# Altium schematic sheet JS7628_base_uart_v1.0.SchDoc
size A4
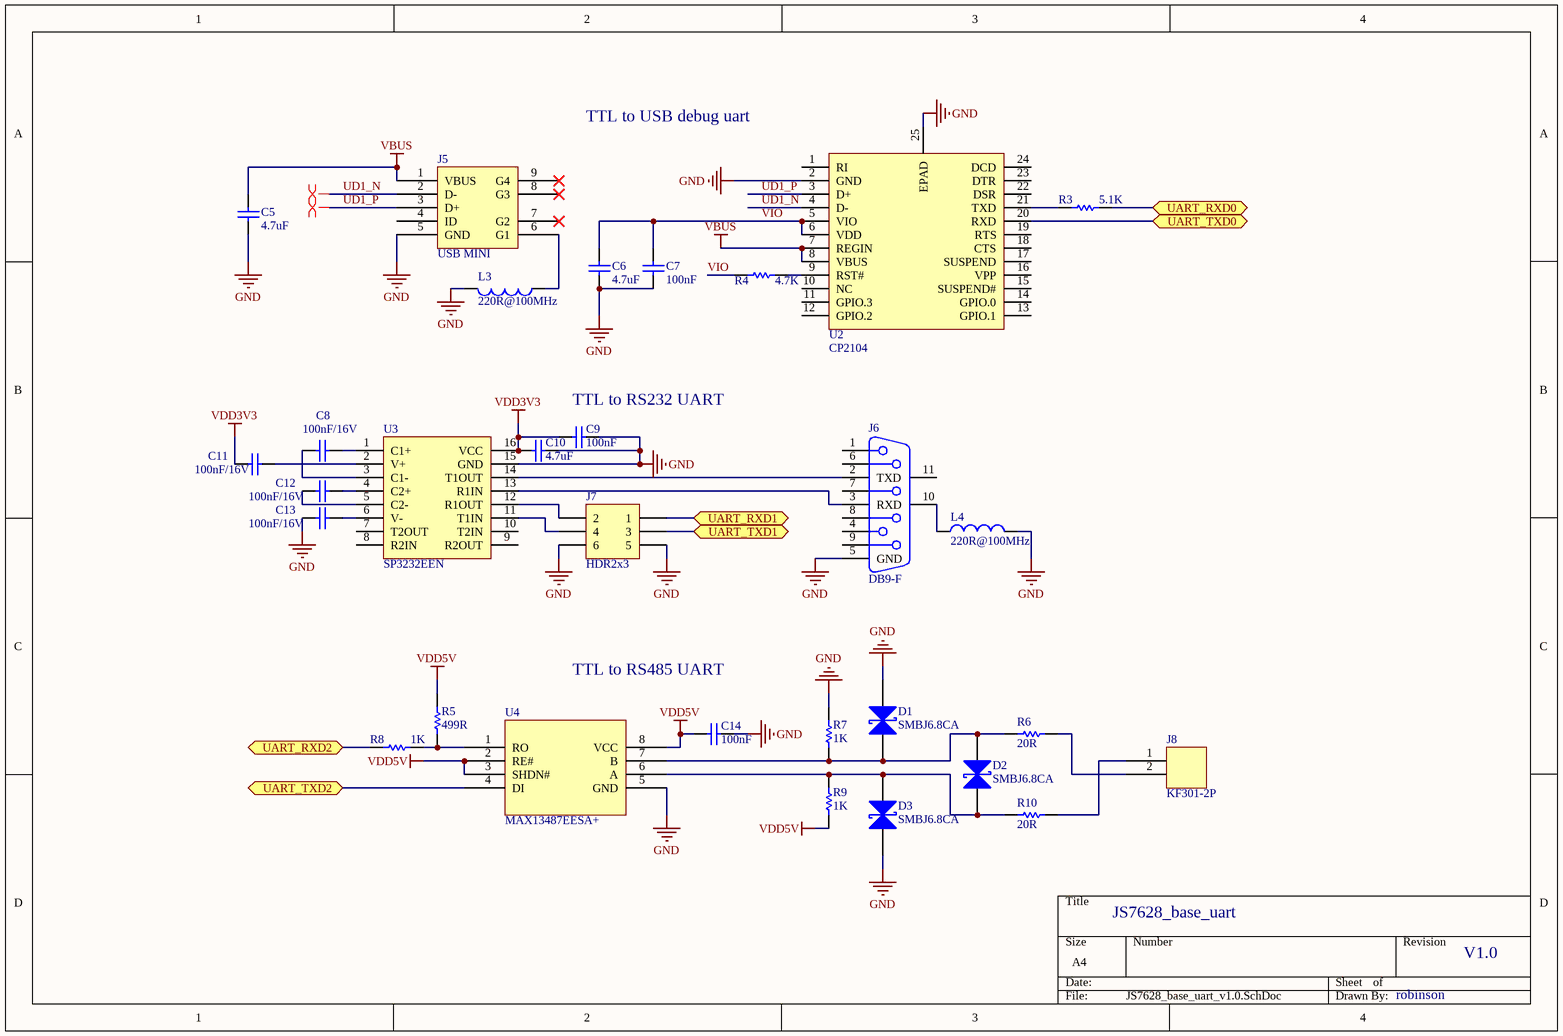
[diagram p0: JS7628_base_uart_v1.0.SchDoc]

## Parts
C5  value 4.7uF  [0603]  (hidden comment: CAP-SMT)
C6  value 4.7uF  [0603]  (hidden comment: CAP-SMT)
C7  value 100nF  [0603]  (hidden comment: CAP-SMT)
C8  value 100nF/16V  [0603]  (hidden comment: CAP-SMT)
C9  value 100nF  [0603]  (hidden comment: CAP-SMT)
C10  value 4.7uF  [0603]  (hidden comment: CAP-SMT)
C11  value 100nF/16V  [0603]  (hidden comment: CAP-SMT)
C12  value 100nF/16V  [0603]  (hidden comment: CAP-SMT)
C13  value 100nF/16V  [0603]  (hidden comment: CAP-SMT)
C14  value 100nF  [0603]  (hidden comment: CAP-SMT)
D1  SMBJ6.8CA  [SMB-BI]
D2  SMBJ6.8CA  [SMB-BI]
D3  SMBJ6.8CA  [SMB-BI]
J5  USB MINI  [USB/SM0.8-6H5]
J6  DB9-F  [DB9-F-90d]
J7  HDR2x3  [HDR2x3-2.54mm]
J8  KF301-2P  [KF301-2P]
L3  value 220R@100MHz  [0603]  (hidden comment: inductor)
L4  value 220R@100MHz  [0603]  (hidden comment: inductor)
R3  value 5.1K  [0603]  (hidden comment: RES-SMT)
R4  value 4.7K  [0603]  (hidden comment: RES-SMT)
R5  value 499R  [0603]  (hidden comment: RES-SMT)
R6  value 20R  [0805]  (hidden comment: RES-SMT)
R7  value 1K  [0603]  (hidden comment: RES-SMT)
R8  value 1K  [0603]  (hidden comment: RES-SMT)
R9  value 1K  [0603]  (hidden comment: RES-SMT)
R10  value 20R  [0805]  (hidden comment: RES-SMT)
U2  CP2104  [QFN-24]
U3  SP3232EEN  [SOIC16_N]
U4  MAX13487EESA+  [SOIC-8P]

## Ports
UART_RXD0, UART_RXD1, UART_RXD2, UART_TXD0, UART_TXD1, UART_TXD2

## Nets
GND: C5.1 C6.1 C7.1 C9.2 C10.2 C13.2 C14.2 D1.2(K) D3.1(A) J5.5(GND) J6.5(GND) J7.5 J7.6 L3.2 L4.2 R7.1 U2.2(GND) U2.25(EPAD) U3.15(GND) U4.5(GND)
VBUS: C5.2 J5.1(VBUS) U2.7(REGIN) U2.8(VBUS)
VDD3V3: C9.1 C10.1 C11.2 U3.16(VCC)
VDD5V: C14.1 R5.1 R9.2 U4.2(RE#) U4.3(SHDN#) U4.8(VCC)
UART_RXD0: R3.2 ; port UART_RXD0
UART_RXD1: J7.1 ; port UART_RXD1
UART_RXD2: R8.1 ; port UART_RXD2
UART_TXD0: U2.20(RXD) ; port UART_TXD0
UART_TXD1: J7.3 ; port UART_TXD1
UART_TXD2: U4.4(DI) ; port UART_TXD2
UD1_N: J5.2(D-) U2.4(D-)
UD1_P: J5.3(D+) U2.3(D+)
VIO: C6.2 C7.2 R4.1 U2.5(VIO) U2.6(VDD)
NetC8_1: C8.1 U3.1(C1+)
NetC8_2: C8.2 U3.3(C1-)
NetC11_1: C11.1 U3.2(V+)
NetC12_1: C12.1 U3.4(C2+)
NetC12_2: C12.2 U3.5(C2-)
NetC13_1: C13.1 U3.6(V-)
NetD1_1: D1.1(A) D2.2(K) R6.1 R7.2 U4.7(B)
NetD2_1: D2.1(A) D3.2(K) R9.1 R10.1 U4.6(A)
NetJ5_6: J5.6(G1) L3.1
NetJ6_2: J6.2(TXD) U3.14(T1OUT)
NetJ6_3: J6.3(RXD) U3.13(R1IN)
NetJ6_10: J6.10(MH1) L4.1
NetJ7_2: J7.2 U3.12(R1OUT)
NetJ7_4: J7.4 U3.11(T1IN)
NetJ8_1: J8.1 R10.2
NetJ8_2: J8.2 R6.2
NetR3_1: R3.1 U2.21(TXD)
NetR4_2: R4.2 U2.9(RST#)
NetR5_2: R5.2 R8.2 U4.1(RO)

Not connected (* = marked no-connect by the designer): J5 4(ID) 7(G2)* 8(G3)* 9(G4)*; J6 1 4 6 7 8 9 11(MH2); U2 1(RI) 10(NC) 11(GPIO.3) 12(GPIO.2) 13(GPIO.1) 14(GPIO.0) 15(SUSPEND#) 16(VPP) 17(SUSPEND) 18(CTS) 19(RTS) 22(DSR) 23(DTR) 24(DCD); U3 7(T2OUT) 8(R2IN) 9(R2OUT) 10(T2IN)

## Layout directives
differential pair: UD1_N, UD1_P

## Notes on the sheet
- TTL to USB debug uart
- (near C9) TTL to RS232 UART
- TTL to RS485 UART
- JS7628_base_uart
- V1.0
- robinson